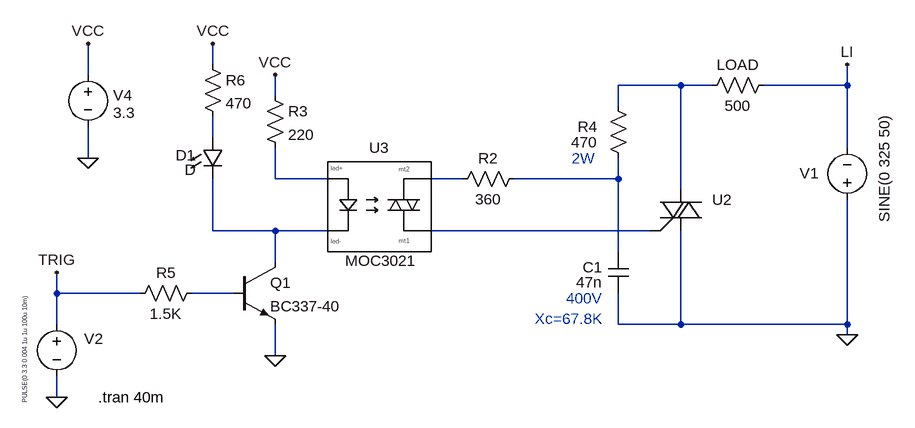
[diagram p0: schematic v2.0.asc]
v2.0.asc, the LTspice schematic file:
Version 4.1
SHEET 1 1132 824
WIRE -1136 -128 -1136 -160
WIRE -1328 -112 -1328 -160
WIRE -416 -96 -512 -96
WIRE -368 -96 -416 -96
WIRE -160 -96 -160 -128
WIRE -160 -96 -288 -96
WIRE -1040 -80 -1040 -112
WIRE -512 -64 -512 -96
WIRE -1136 -16 -1136 -48
WIRE -160 0 -160 -96
WIRE -1328 16 -1328 -32
WIRE -1040 48 -1040 0
WIRE -960 48 -1040 48
WIRE -752 48 -800 48
WIRE -512 48 -512 16
WIRE -512 48 -672 48
WIRE -416 64 -416 -96
WIRE -1136 128 -1136 48
WIRE -1040 128 -1136 128
WIRE -960 128 -1040 128
WIRE -464 128 -800 128
WIRE -512 160 -512 48
WIRE -1040 176 -1040 128
WIRE -1376 224 -1376 192
WIRE -1248 224 -1376 224
WIRE -1104 224 -1168 224
WIRE -1376 272 -1376 224
WIRE -512 272 -512 224
WIRE -416 272 -416 128
WIRE -416 272 -512 272
WIRE -160 272 -160 80
WIRE -160 272 -416 272
WIRE -160 288 -160 272
WIRE -1040 320 -1040 272
WIRE -1376 384 -1376 352
FLAG -160 288 0
FLAG -1376 384 0
FLAG -1040 320 0
FLAG -160 -128 LI
FLAG -1376 192 TRIG
FLAG -1328 16 0
FLAG -1040 -112 VCC
FLAG -1328 -160 VCC
FLAG -1136 -160 VCC
SYMBOL res -272 -112 R90
WINDOW 0 0 56 VBottom 2
WINDOW 3 32 56 VTop 2
SYMATTR InstName LOAD
SYMATTR Value 500
SYMBOL res -768 64 R270
WINDOW 0 32 56 VTop 2
WINDOW 3 0 56 VBottom 2
SYMATTR InstName R2
SYMATTR Value 360
SYMBOL voltage -160 96 R180
WINDOW 123 0 0 Left 0
WINDOW 39 0 0 Left 0
WINDOW 0 44 57 Left 2
WINDOW 3 -57 -19 VRight 2
SYMATTR InstName V1
SYMATTR Value SINE(0 325 50)
SYMBOL res -1056 -96 R0
SYMATTR InstName R3
SYMATTR Value 220
SYMBOL voltage -1376 256 R0
WINDOW 3 -49 -29 VRight 0
WINDOW 123 0 0 Left 0
WINDOW 39 0 0 Left 0
WINDOW 0 42 38 Left 2
SYMATTR Value PULSE(0 3.3 0.004 1u 1u 100u 10m)
SYMATTR InstName V2
SYMBOL res -496 32 R180
WINDOW 0 48 64 Left 2
WINDOW 3 48 40 Left 2
SYMATTR InstName R4
SYMATTR Value 470
SYMATTR SpiceLine pwr=2
SYMBOL cap -528 160 R0
WINDOW 0 -39 24 Left 2
WINDOW 3 -49 47 Left 2
SYMATTR InstName C1
SYMATTR Value 47n
SYMATTR SpiceLine V=400
SYMBOL npn -1104 176 R0
SYMATTR InstName Q1
SYMATTR Value BC337-40
SYMBOL voltage -1328 -128 R0
WINDOW 0 39 47 Left 2
WINDOW 3 39 74 Left 2
WINDOW 123 0 0 Left 0
WINDOW 39 0 0 Left 0
SYMATTR InstName V4
SYMATTR Value 3.3
SYMBOL res -1152 208 R90
WINDOW 0 0 56 VBottom 2
WINDOW 3 32 56 VTop 2
SYMATTR InstName R5
SYMATTR Value 1.5K
SYMBOL LED -1152 -16 R0
WINDOW 0 -41 28 Left 2
WINDOW 3 -27 50 Left 2
SYMATTR InstName D1
SYMBOL res -1152 -144 R0
SYMATTR InstName R6
SYMATTR Value 470
SYMBOL MyLib\\Opto\\MOC3021 -912 64 R0
SYMATTR InstName U3
SYMBOL MyLib\\TRIAC\\TRIAC_ST -448 64 R0
SYMATTR InstName U2
TEXT -1312 384 Left 2 !.tran 40m
TEXT -536 232 Right 2 ;400V\nXc=67.8K
TEXT -584 16 Left 2 ;2W

The netlist it stands for:
* v2.0.asc
R§LOAD LI N001 500
R2 N004 N005 360
V1 0 LI SINE(0 325 50)
R3 VCC N003 220
V2 TRIG 0 PULSE(0 3.3 0.004 1u 1u 100u 10m)
R4 N005 N001 470 pwr=2
C1 N005 0 47n V=400
Q1 N006 N008 0 0 BC337-40
V4 VCC 0 3.3
R5 N008 TRIG 1.5K
D1 N002 N006 D
R6 VCC N002 470
X§U3 N003 N006 N004 N007 MOC3021  ; pins led+ led- mt2 mt1
X§U2 N001 N007 0 BTA16-600B  ; pins MT2 G MT1
.model D D
.lib standard.dio
.model NPN NPN
.model PNP PNP
.lib standard.bjt
.tran 40m
* 400V
* Xc=67.8K
* 2W
.lib MyLib/Opto/MOC3021.lib
.lib MyLib/TRIAC/TRIAC_ST.lib
.backanno
.end

* Results of the author's LTspice run, read from the files saved beside the schematic
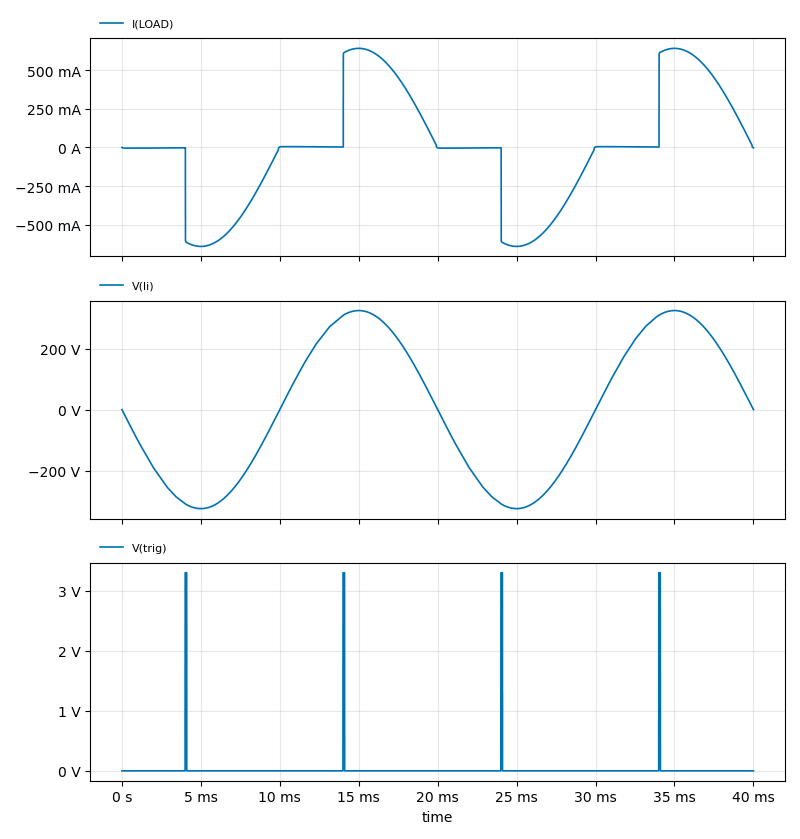
[diagram p1: Transient Analysis of v2.0.asc, plotted from the saved traces]
* Transient Analysis, 1 run:
*   I(LOAD): min -640.4 mA, max 640.4 mA, average 3.931 µA, rms 375.7 mA, last -3.054 mA
*   V(li): min -325 V, max 325 V, average -4.461 mV, rms 229.9 V, last 0 V
*   V(trig): min 0 V, max 3.3 V, average 33.33 mV, rms 331.3 mV, last 0 V